# Altium project Soccer_Bop_IT.PrjPcb
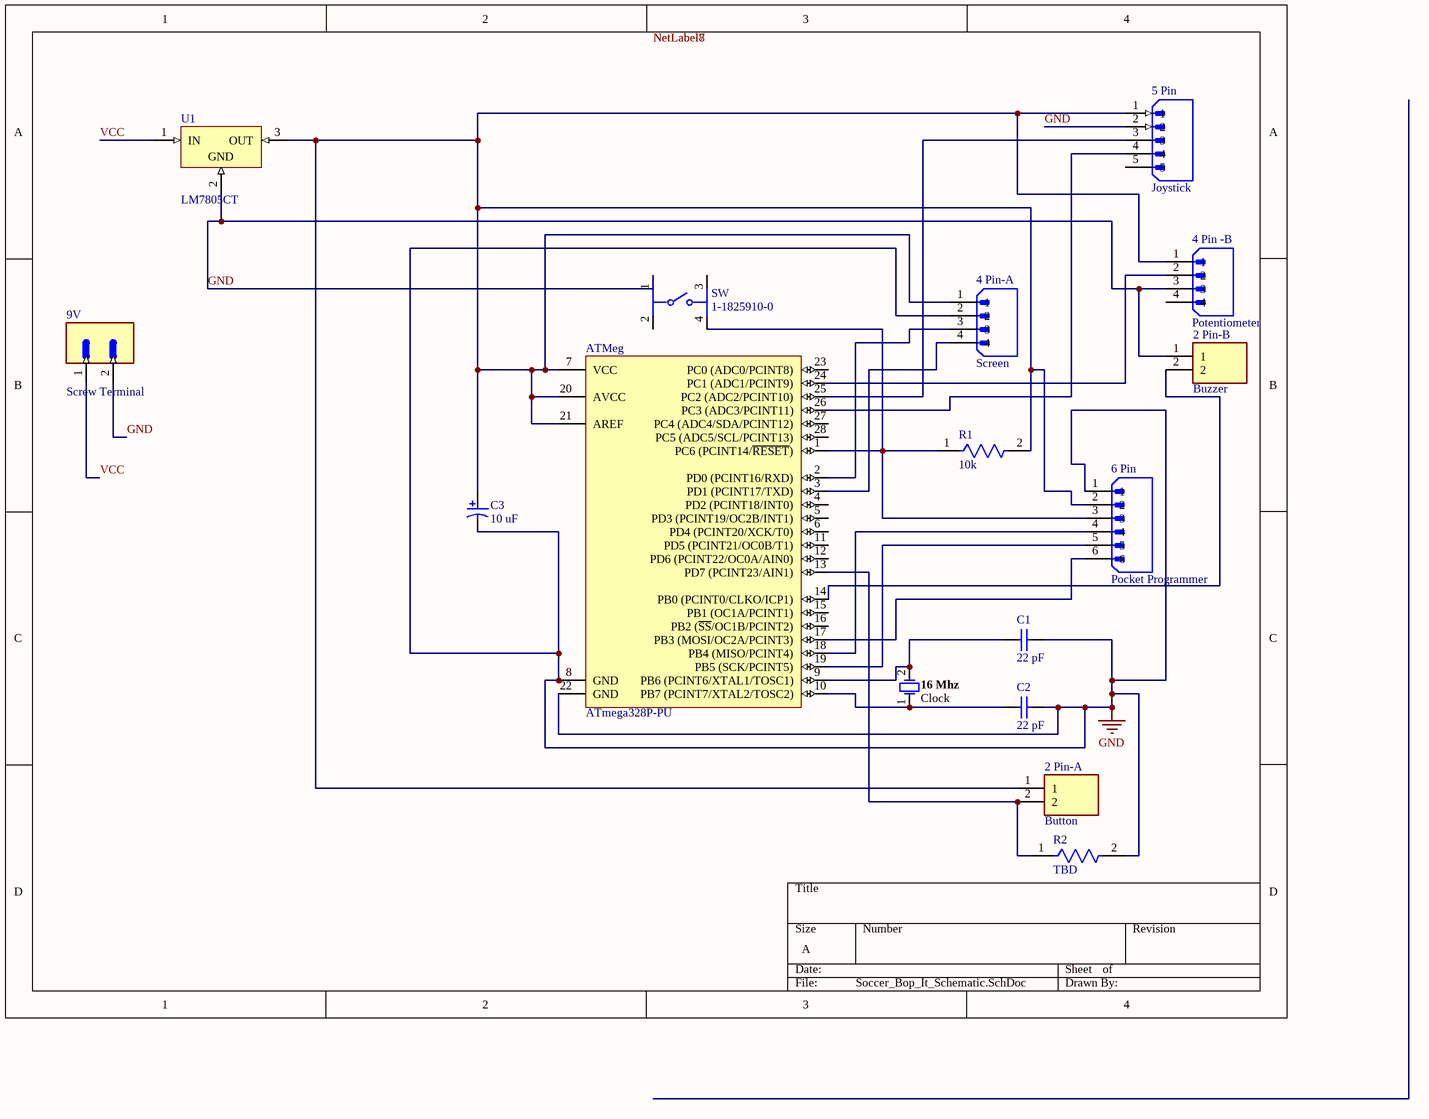
[diagram p0: Soccer_Bop_It_Schematic.SchDoc]
1 sheet, 16 parts. Net scope: global (net labels, ports and power ports of the same name join across sheets).
Board file: Soccer_Bop_It_Schematic.PcbDoc

## Sheet Soccer_Bop_It_Schematic.SchDoc
size A; SheetNumber: 1; SheetTotal: 1

### Parts
2_Pin-A  Button  [JST_B2B-XH-A(LF)(SN)]
2_Pin-B  Buzzer  [JST_B2B-XH-A(LF)(SN)]
4_Pin-A  Screen  [JST_B4B-XH-A(LF)(SN)]
4_Pin_-B  Potentiometer  [JST_B4B-XH-A(LF)(SN)]
5_Pin  Joystick  [JST_B5B-XH-A(LF)(SN)]
6_Pin  Pocket Programmer  [JST_B6B-XH-A(LF)(SN)]
9V  Screw Terminal  [1760490000]
16_Mhz  Clock  [FOX-FOXSLF160-20]
ATMeg  ATmega328P-PU  [28P3]
C1  22 pF  [KEMT-C315-THT-2]
C2  22 pF  [KEMT-C315-THT-2]
C3  10 uF  [PNSC-EEU-EE2G100-2_V]
R1  10k  [FP-MRS25-MFG]
R2  TBD  [FP-MRS25-MFG]
SW  1-1825910-0  [FP-1-1825910-0-MFG]
U1  LM7805CT  [FAIR-TO-220-3]

### Nets
GND: 2_Pin-B.1 4_Pin-A.2 4_Pin_-B.3 5_Pin.2 6_Pin.1 9V.2 ATMeg.8(GND) ATMeg.22(GND) C1.2 C2.2 C3.2 R2.2 SW.1 U1.2(GND)
VCC: 9V.1 U1.1(IN)
Net2_Pin-A_1: 2_Pin-A.1 4_Pin-A.1 4_Pin_-B.1 5_Pin.1 6_Pin.2 ATMeg.7(VCC) ATMeg.20(AVCC) ATMeg.21(AREF) C3.1 R1.2 U1.3(OUT)
Net2_Pin-A_2: 2_Pin-A.2 ATMeg.13(PD7_(PCINT23/AIN1)) R2.1
Net2_Pin-B_2: 2_Pin-B.2 ATMeg.14(PB0_(PCINT0/CLKO/ICP1))
Net4_Pin-A_3: 4_Pin-A.3 ATMeg.2(PD0_(PCINT16/RXD))
Net4_Pin-A_4: 4_Pin-A.4 ATMeg.3(PD1_(PCINT17/TXD))
Net4_Pin_-B_2: 4_Pin_-B.2 ATMeg.24(PC1_(ADC1/PCINT9))
Net5_Pin_3: 5_Pin.3 ATMeg.25(PC2_(ADC2/PCINT10))
Net5_Pin_4: 5_Pin.4 ATMeg.26(PC3_(ADC3/PCINT11))
Net6_Pin_3: 6_Pin.3 ATMeg.1(PC6_(PCINT14/~{RESET})) R1.1 SW.4
Net6_Pin_4: 6_Pin.4 ATMeg.18(PB4_(MISO/PCINT4))
Net6_Pin_5: 6_Pin.5 ATMeg.19(PB5_(SCK/PCINT5))
Net6_Pin_6: 6_Pin.6 ATMeg.17(PB3_(MOSI/OC2A/PCINT3))
Net16_Mhz_1: 16_Mhz.1 ATMeg.10(PB7_(PCINT7/XTAL2/TOSC2)) C2.1
Net16_Mhz_2: 16_Mhz.2 ATMeg.9(PB6_(PCINT6/XTAL1/TOSC1)) C1.1

Not connected (* = marked no-connect by the designer): 4_Pin_-B 4; 5_Pin 5; ATMeg 4(PD2_(PCINT18/INT0)) 5(PD3_(PCINT19/OC2B/INT1)) 6(PD4_(PCINT20/XCK/T0)) 11(PD5_(PCINT21/OC0B/T1)) 12(PD6_(PCINT22/OC0A/AIN0)) 15(PB1_(OC1A/PCINT1)) 16(PB2_(~{SS}/OC1B/PCINT2)) 23(PC0_(ADC0/PCINT8)) 27(PC4_(ADC4/SDA/PCINT12)) 28(PC5_(ADC5/SCL/PCINT13)); SW 2 3

### Library data of the parts
2_Pin-A 2_Pin-B = B2B-XH-A(LF)(SN): Connector Header Through Hole 2 position 0.098" (2.50mm); MF: JST Sales; Check_prices: https://www.snapeda.com/parts/B2B-XH-A(LF)(SN)/JST+Sales+America+Inc./view-part/?ref=eda; Value: *; SnapEDA_Link: https://www.snapeda.com/parts/B2B-XH-A(LF)(SN)/JST+Sales+America+Inc./view-part/?ref=snap; Availability: Unavailable; Price: None; Package: None; MP: B2B-XH-A(LF)(SN)
4_Pin-A = B4B-XH-A(LF)(SN): Connector Header Through Hole 4 position 0.098 (2.50mm); MF: JST Sales; SnapEDA_Link: https://www.snapeda.com/parts/B4B-XH-A(LF)(SN)/JST+Sales+America+Inc./view-part/?ref=snap; Package: None; MP: B4B-XH-A(LF)(SN); Check_prices: https://www.snapeda.com/parts/B4B-XH-A(LF)(SN)/JST+Sales+America+Inc./view-part/?ref=eda; Purchase-URL: https://pricing.snapeda.com/search/part/B4B-XH-A(LF)(SN)/?ref=eda; Price: None; Value: *; Availability: In Stock
4_Pin_-B = B4B-XH-A(LF)(SN): MF: JST Sales; SnapEDA_Link: https://www.snapeda.com/parts/B4B-XH-A(LF)(SN)/JST+Sales+America+Inc./view-part/?ref=snap; Package: None; MP: B4B-XH-A(LF)(SN); Check_prices: https://www.snapeda.com/parts/B4B-XH-A(LF)(SN)/JST+Sales+America+Inc./view-part/?ref=eda; Purchase-URL: https://pricing.snapeda.com/search/part/B4B-XH-A(LF)(SN)/?ref=eda; Price: None; Value: *; Availability: In Stock
5_Pin = B5B-XH-A(LF)(SN): Connector Header Through Hole 5 position 0.098 (2.50mm); MF: JST Sales America Inc.; SnapEDA_Link: https://www.snapeda.com/parts/B5B-XH-A(LF)(SN)/JST+Sales+America+Inc./view-part/?ref=snap; Price: None; Check_prices: https://www.snapeda.com/parts/B5B-XH-A(LF)(SN)/JST+Sales+America+Inc./view-part/?ref=eda; Purchase-URL: https://pricing.snapeda.com/search/part/B5B-XH-A(LF)(SN)/?ref=eda; Value: *; MP: B5B-XH-A(LF)(SN); Package: None; Availability: In Stock
6_Pin = B6B-XH-A(LF)(SN): Connector Header Through Hole 6 position 0.098 (2.50mm); MF: JST Sales; MP: B6B-XH-A(LF)(SN); SnapEDA_Link: https://www.snapeda.com/parts/B6B-XH-A(LF)(SN)/JST+Sales+America+Inc./view-part/?ref=snap; Price: None; Check_prices: https://www.snapeda.com/parts/B6B-XH-A(LF)(SN)/JST+Sales+America+Inc./view-part/?ref=eda; Availability: In Stock; Package: None; Purchase-URL: https://pricing.snapeda.com/search/part/B6B-XH-A(LF)(SN)/?ref=eda; Value: *
9V = 1760510000: 2 Position Wire to Board Terminal Block Horizontal with Board 0.200 _5.08mm_ Through Hole; MF: Weidmuller; Package: None; Price: None; SnapEDA_Link: https://www.snapeda.com/parts/1760510000/Weidmuller/view-part/286722/?ref=snap; Availability: Unavailable; Value: *; MP: 1760510000
16_Mhz = CMP-1749-00003-1: Resistance Weld Thru-Hole Crystal, 16 MHz, -20 to 70 degC, 2-Pin THD, RoHS, Bulk; Voltage Rating: 250 V; Tolerance: 1%; Resistance: 221 kohm; Case\Package: Axial; Power Rating: 250 mW; RoHSCompliant: true; Package Quantity: 200; Packaging: Bulk; Min Operating Temperature: -55 degC; DatasheetVersion: Mar-15; ComponentLink1URL: http://www.foxonline.com/; Max Operating Temperature: 155 degC; PackageReference: FOXSLF160-20; Mount: Through Hole; PackageDescription: 2-Pin Through Hole Device, Body 11.35 x 4.65 mm; ComponentLink1Description: Manufacturer URL; ComponentLink2URL: http://www.foxonline.com/pdfs/hc49slf.pdf; ComponentLink2Description: Datasheet; Length: 0.248 inch
ATMeg = CMP-0095-00013-2: 8-bit AVR Microcontroller, 32KB Flash, 1KB EEPROM, 2KB SRAM, 28-pin PDIP, Industrial Grade (-40°C to 85°C); RevisionNote: DatasheetVersion updated. URLs added.; PackageVersion: revB, Sep-2001; PackageDescription: 28-lead (0.300"/7.62mm Wide) Plastic Dual Inline Package (PDIP); DatasheetVersion: revD, May-2011; ComponentLink1Description: Manufacturer URL; ComponentLink1URL: http://www.atmel.com/; PackageReference: 28P3; ComponentLink2Description: ATmega48A/48PA/88A/88PA/168A/168PA/328/328P Datasheet; ComponentLink3URL: http://www.atmel.com/dyn/resources/prod_documents/8271S.pdf; ComponentLink2URL: http://www.atmel.com/dyn/resources/prod_documents/8271.pdf; ComponentLink3Description: ATmega48A/48PA/88A/88PA/168A/168PA/328/328P Summary
C1 C2 = CMP-1664-00008-1: Capacitor, Ceramic, 22 pF, +/-10 %, 100 V, -55 to 125 degC, 2-Pin THD, RoHS, Bulk; Max Input Voltage: 40 V; Min Input Voltage: 4.2 V; Output Current: 1.5 A; Output Voltage: 1.2 V; Outputs: 1; Case\Package: TO-220; RoHSCompliant: true; Min Operating Temperature: 0 degC; Max Operating Temperature: 125 degC; Package Quantity: 50; ComponentLink2URL: http://capacitoredge.kemet.com/capedge2/DataSheet/Datasheet-C315C220K1G5TA.pdf?pn=C315C220K1G5TA{BULK}; Radiation Hardening: No; Pins: 3; Length: 10.28 mm; ComponentLink1URL: http://www.kemet.com/; ComponentLink2Description: Datasheet; Height: 9.28 mm; REACH SVHC: No SVHC; ComponentLink1Description: Manufacturer URL; Max Ouput Current: 1.5 A; Weight: 0.08113 oz; Packaging: Rail/Tube; DatasheetVersion: Aug-16; Mount: Through Hole; PackageReference: C315-THT-2; Width: 4.82 mm; PackageDescription: 2-Pin Through Hole Device, Body 3.81 x 2.54 mm
C3 = CMP-0736-00002-1: Aluminum Electrolytic Capacitor, 10 uF +/- 20%, 400 V, -25 to 105 degC, 2-Pin 10 x 10 x 22 mm Through-hole, RoHS, Tape and Reel; PartNumber: EEU-EE2G100; Manufacturer: Panasonic; Ripple Current: 430 mA; Rated Voltage: 400 V; Capacitance Tolerance: +/- 20%; ComponentLink2URL: http://industrial.panasonic.com/www-data/pdf/ABA0000/ABA0000CE113.pdf; Mounting Technology: Through Hole; PackageVersion: Nov-12; ComponentLink3URL: http://industrial.panasonic.com/www-data/pdf/ABA0000/ABA0000PE245.pdf; ComponentLink2Description: Datasheet; DatasheetVersion: Nov-12; PackageDescription: 2-Pin Through-hole, Base 10 x 10 mm, Height 22 mm; PackageReference: EEU-EE2G100-2; ComponentLink1URL: http://industrial.panasonic.com/; Temp. Range: -25 to 105 degC; RoHS: TRUE; Packing: Tape and Reel; Cap.: 10 uF; ComponentLink1Description: Manufacturer URL; ComponentLink3Description: Package Specification
R1 R2 = CMP-02408-000051-1: RES 1K OHM 0.6W 1% AXIAL; Power Rating: 600mW; Lead Diameter: 0.6mm; Voltage Rating (DC): 350V; Resistance: 1kR; Temperature Coefficient: 50ppm/°C; Width: 2.5mm; Military Standard: Not; Package Quantity: 5000; Radiation Hardening: No; Case/Package: Axial; Resistance Tolerance: 1%; Resistor Type: Metal Film; Contact Plating: Tin; Length: 6.5mm; Lead Free: Lead Free; RoHS Compliant: Yes; Mount: Through Hole; Number of Pins: 2; Technology: THIN FILM; Voltage Rating: 350V; Min Operating Temperature: -55°C; Weight: 0.00776oz; Diameter: 2.5mm; Construction: Cylindrical; Series: MRS25; Tolerance: 1%; Packaging: Tape and Reel; Max Operating Temperature: 155°C; Max Power Dissipation: 600mW; Number of Terminations: 2; Termination: Axial
SW = CMP-03407-000018-1: SWITCH TACTILE SPST-NO 0.05A 24V; Switch Function: Off-Mom; Mechanical Life: 100000Cycles; Actuator Material: Nylon; Actuator Color: Blue; Contact Current Rating: 50mA; Illumination Type: Non-Illuminated; Throw Configuration: SPST; Actuator Length: 3.4mm; Operating Force: 1.56N; Actuator Type: Standard; Contact Resistance: 100mR; Switch Travel: 0.25mm; Depth: 5.99mm; Contact Plating: Silver; Max Operating Temperature: 85°C; Electrical Life: 100000Cycles; Min Operating Temperature: -35°C; RoHS Compliant: Yes; Max Voltage Rating (DC): 24V; Mount: Through Hole; Packaging: Loose Piece; Length: 5.99mm; Series: FSMJ, Alcoswitch; Orientation: Straight; Contact Material: Brass; Radiation Hardening: No; Package Quantity: 750; Max Current Rating: 50mA; Termination: PC Pins; Type: Switch; Voltage Rating (DC): 24V
U1 = CMP-2000-04938-1: Positive Voltage Regulator, 5 V, 1 A, -40 to 125 degC, 3-Pin TO-220, RoHS, Tube; Manufacturer: FairchildSemiconductor; Maximum Input Voltage: 35V; Maximum Quiescent Current: 8mA; Load Regulation: 100mV; Maximum Output Current: 2.2(Typ)A; Output Type: Fixed; Typical Dropout Voltage @ Current: 2@1AV; Rad Hard: No; Output Voltage: 5V; Accuracy: ±4%; Number of Outputs: 1; Category: LinearRegulator; Package Description: 3-Pin Through Hole Device, Body 10 x 4.5 mm, Pitch 2.54 mm; Packaging: Rail/Tube; Mounting: ThroughHole; Polarity: Positive; Manufacturer URL: https://www.fairchildsemi.com/; Line Regulation: 100mV; Datasheet Version: Aug-12; Datasheet URL: https://datasheet.ciiva.com/26904/lm7805ct-26904988.pdf; Package Reference: TO-220; Package URL: https://www.fairchildsemi.com/package-drawings/TO/TO220B03.pdf; Package: 3TO-220AB; Operating Temperature: -40to125degC; Type: Linear